# Altium schematic sheet Page01 COVER.SchDoc
size 513 x 386 mm
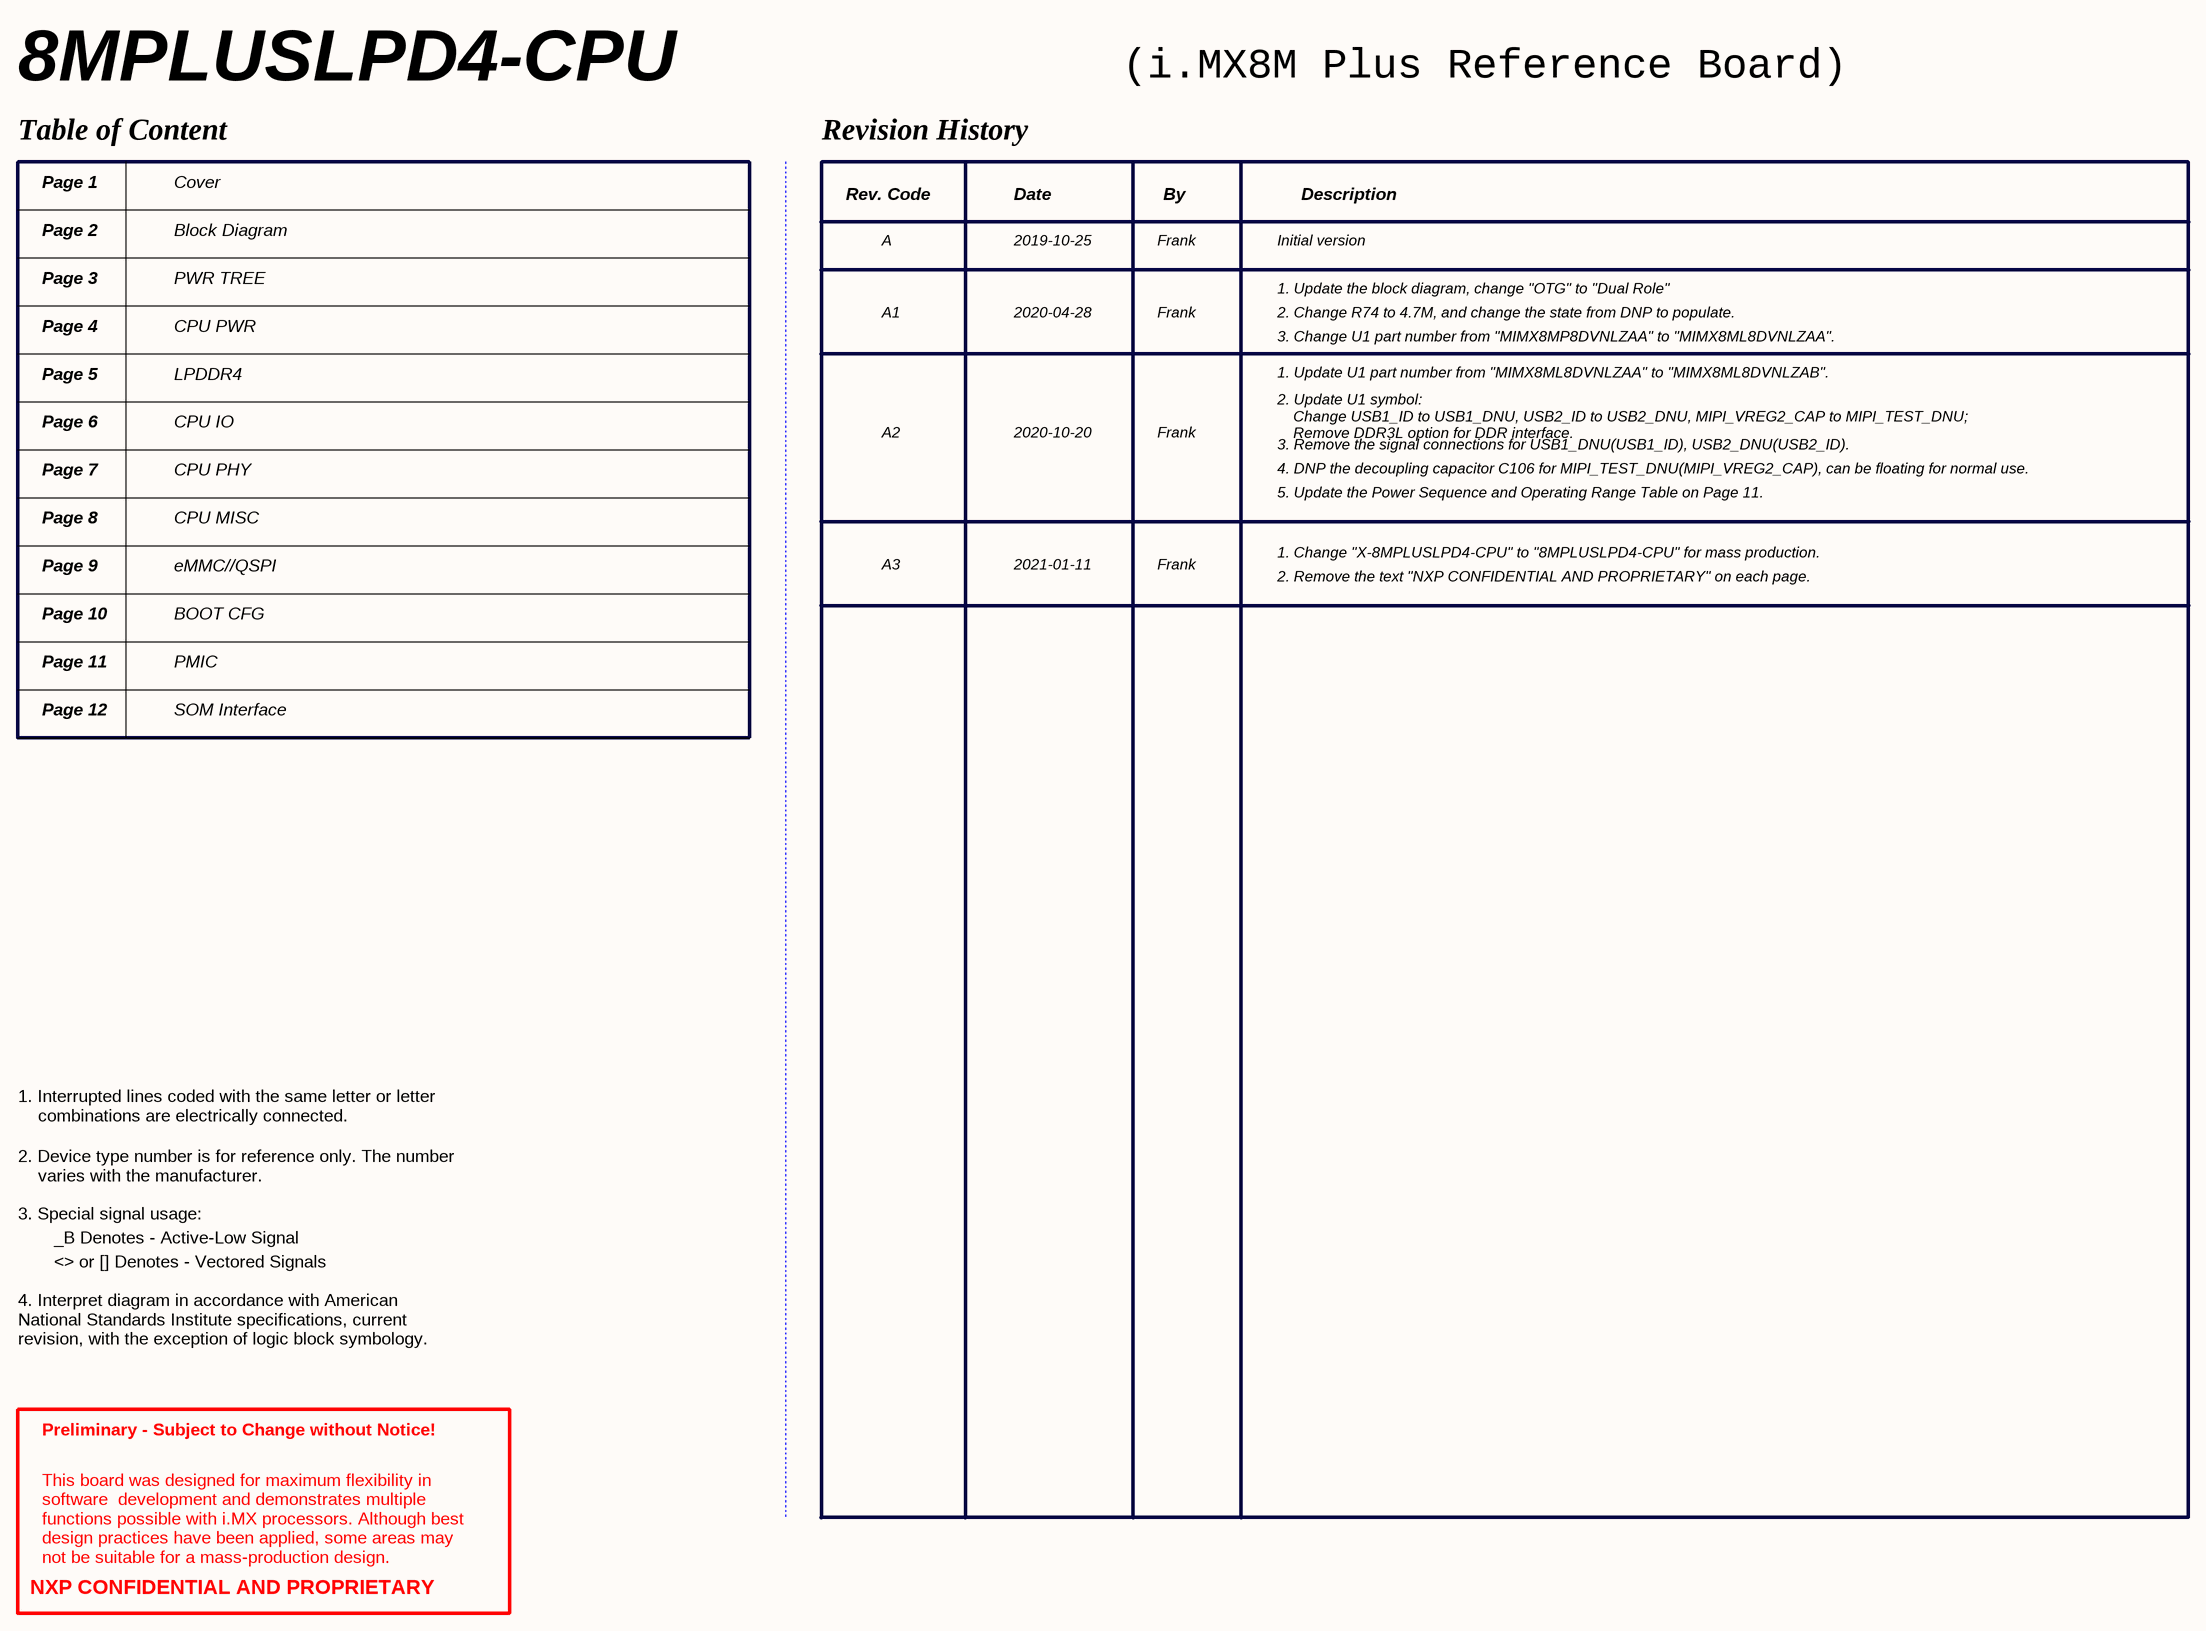
[diagram p0: Page01 COVER.SchDoc]

## Notes on the sheet
- 8MPLUSLPD4-CPU
- (i.MX8M Plus Reference Board)
- Table of Content
- Revision History
- Page 1
- Page 2
- Cover
- Block Diagram
- Rev. Code
- A
- Date
- 2019-10-25
- Frank
- By
- Initial version
- Description
- Page 3
- PWR TREE
- 1. Update the block diagram, change "OTG" to "Dual Role"
- Page 4
- CPU PWR
- A1
- 2020-04-28
- 2. Change R74 to 4.7M, and change the state from DNP to populate.
- 3. Change U1 part number from "MIMX8MP8DVNLZAA" to "MIMX8ML8DVNLZAA".
- Page 5
- LPDDR4
- 1. Update U1 part number from "MIMX8ML8DVNLZAA" to "MIMX8ML8DVNLZAB".
- 2. Update U1 symbol:
  Change USB1_ID to USB1_DNU, USB2_ID to USB2_DNU, MIPI_VREG2_CAP to MIPI_TEST_DNU;
  Remove DDR3L option for DDR interface.
- Page 6
- Page 7
- CPU IO
- CPU PHY
- A2
- 2020-10-20
- 3. Remove the signal connections for USB1_DNU(USB1_ID), USB2_DNU(USB2_ID).
- 4. DNP the decoupling capacitor C106 for MIPI_TEST_DNU(MIPI_VREG2_CAP), can be floating for normal use.
- Page 8
- CPU MISC
- 5. Update the Power Sequence and Operating Range Table on Page 11.
- Page 9
- eMMC//QSPI
- A3
- 2021-01-11
- 1. Change "X-8MPLUSLPD4-CPU" to "8MPLUSLPD4-CPU" for mass production.
- 2. Remove the text "NXP CONFIDENTIAL AND PROPRIETARY" on each page.
- Page 10
- BOOT CFG
- Page 11
- Page 12
- PMIC
- SOM Interface
- 1. Interrupted lines coded with the same letter or letter
  combinations are electrically connected.
- 2. Device type number is for reference only. The number
  varies with the manufacturer.
- 3. Special signal usage:
- _B Denotes - Active-Low Signal
- 4. Interpret diagram in accordance with American
  National Standards Institute specifications, current
  revision, with the exception of logic block symbology.
- <> or [] Denotes - Vectored Signals
- Preliminary - Subject to Change without Notice!
- This board was designed for maximum flexibility in
  software  development and demonstrates multiple
  functions possible with i.MX processors. Although best
  design practices have been applied, some areas may
  not be suitable for a mass-production design.
- NXP CONFIDENTIAL AND PROPRIETARY